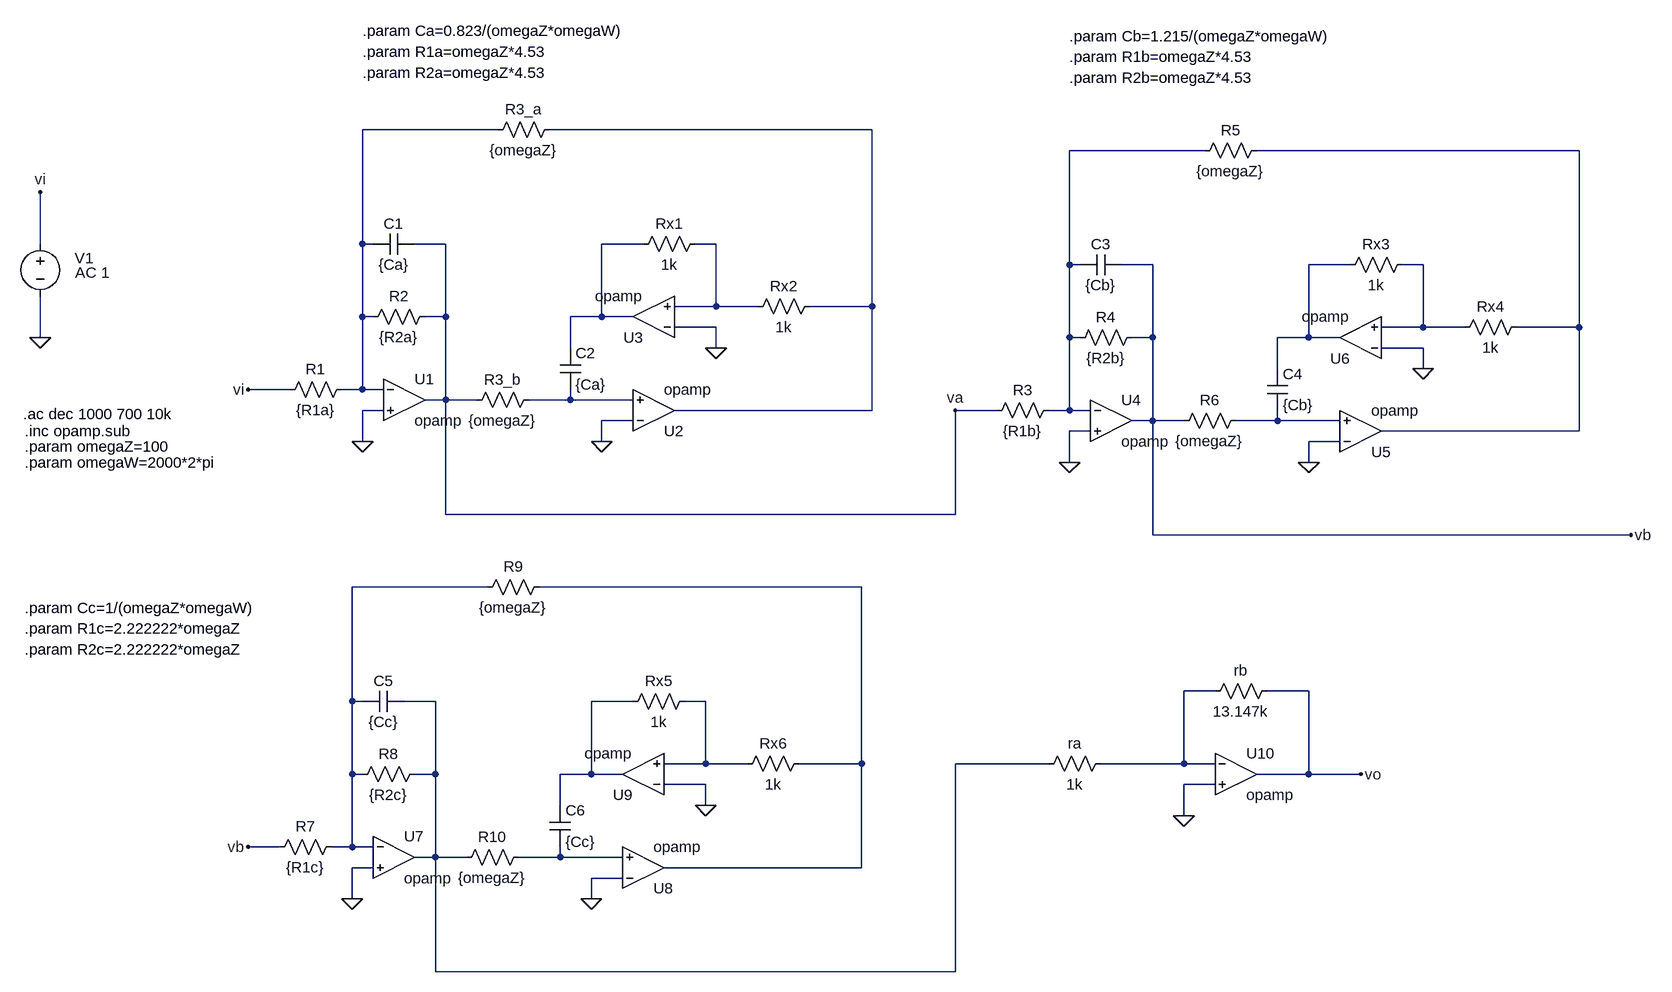
[diagram p0: schematic Draft1.asc]
Draft1.asc, the LTspice schematic file:
Version 4
SHEET 1 1100 680
WIRE -688 -704 -896 -704
WIRE -112 -704 -608 -704
WIRE 400 -672 192 -672
WIRE 976 -672 480 -672
WIRE -1392 -528 -1392 -608
WIRE -896 -528 -896 -704
WIRE -880 -528 -896 -528
WIRE -768 -528 -816 -528
WIRE -464 -528 -528 -528
WIRE -352 -528 -384 -528
WIRE 192 -496 192 -672
WIRE 208 -496 192 -496
WIRE 320 -496 272 -496
WIRE 624 -496 560 -496
WIRE 736 -496 704 -496
WIRE -352 -432 -352 -528
WIRE -352 -432 -416 -432
WIRE -288 -432 -352 -432
WIRE -112 -432 -112 -704
WIRE -112 -432 -208 -432
WIRE -896 -416 -896 -528
WIRE -880 -416 -896 -416
WIRE -768 -416 -768 -528
WIRE -768 -416 -800 -416
WIRE -528 -416 -528 -528
WIRE -528 -416 -576 -416
WIRE -480 -416 -528 -416
WIRE -352 -400 -416 -400
WIRE 736 -400 736 -496
WIRE 736 -400 672 -400
WIRE 800 -400 736 -400
WIRE 976 -400 976 -672
WIRE 976 -400 880 -400
WIRE -1392 -384 -1392 -448
WIRE 192 -384 192 -496
WIRE 208 -384 192 -384
WIRE 320 -384 320 -496
WIRE 320 -384 288 -384
WIRE 560 -384 560 -496
WIRE 560 -384 512 -384
WIRE 608 -384 560 -384
WIRE -576 -368 -576 -416
WIRE -352 -368 -352 -400
WIRE 736 -368 672 -368
WIRE 512 -336 512 -384
WIRE 736 -336 736 -368
WIRE -1008 -304 -1072 -304
WIRE -896 -304 -896 -416
WIRE -896 -304 -928 -304
WIRE -864 -304 -896 -304
WIRE -768 -288 -768 -416
WIRE -768 -288 -800 -288
WIRE -720 -288 -768 -288
WIRE -576 -288 -576 -304
WIRE -576 -288 -640 -288
WIRE -480 -288 -576 -288
WIRE -864 -272 -896 -272
WIRE -112 -272 -112 -432
WIRE -112 -272 -416 -272
WIRE 80 -272 16 -272
WIRE 192 -272 192 -384
WIRE 192 -272 160 -272
WIRE 224 -272 192 -272
WIRE -480 -256 -528 -256
WIRE 320 -256 320 -384
WIRE 320 -256 288 -256
WIRE 368 -256 320 -256
WIRE 512 -256 512 -272
WIRE 512 -256 448 -256
WIRE 608 -256 512 -256
WIRE 224 -240 192 -240
WIRE 976 -240 976 -400
WIRE 976 -240 672 -240
WIRE -896 -224 -896 -272
WIRE -528 -224 -528 -256
WIRE 608 -224 560 -224
WIRE 192 -192 192 -240
WIRE 560 -192 560 -224
WIRE -768 -112 -768 -288
WIRE 16 -112 16 -272
WIRE 16 -112 -768 -112
WIRE 320 -80 320 -256
WIRE 1056 -80 320 -80
WIRE -704 0 -912 0
WIRE -128 0 -624 0
WIRE 416 160 368 160
WIRE 560 160 496 160
WIRE -912 176 -912 0
WIRE -896 176 -912 176
WIRE -784 176 -832 176
WIRE -480 176 -544 176
WIRE -368 176 -400 176
WIRE -368 272 -368 176
WIRE -368 272 -432 272
WIRE -304 272 -368 272
WIRE -128 272 -128 0
WIRE -128 272 -224 272
WIRE 160 272 16 272
WIRE 368 272 368 160
WIRE 368 272 240 272
WIRE 416 272 368 272
WIRE -912 288 -912 176
WIRE -896 288 -912 288
WIRE -784 288 -784 176
WIRE -784 288 -816 288
WIRE -544 288 -544 176
WIRE -544 288 -592 288
WIRE -496 288 -544 288
WIRE 560 288 560 160
WIRE 560 288 480 288
WIRE 640 288 560 288
WIRE -368 304 -432 304
WIRE 416 304 368 304
WIRE -592 336 -592 288
WIRE -368 336 -368 304
WIRE 368 352 368 304
WIRE -1024 400 -1072 400
WIRE -912 400 -912 288
WIRE -912 400 -944 400
WIRE -880 400 -912 400
WIRE -784 416 -784 288
WIRE -784 416 -816 416
WIRE -736 416 -784 416
WIRE -592 416 -592 400
WIRE -592 416 -656 416
WIRE -496 416 -592 416
WIRE -880 432 -912 432
WIRE -128 432 -128 272
WIRE -128 432 -432 432
WIRE -496 448 -544 448
WIRE -912 480 -912 432
WIRE -544 480 -544 448
WIRE -784 592 -784 416
WIRE 16 592 16 272
WIRE 16 592 -784 592
FLAG -352 -368 0
FLAG -528 -224 0
FLAG -896 -224 0
FLAG 736 -336 0
FLAG 560 -192 0
FLAG 192 -192 0
FLAG -368 336 0
FLAG -544 480 0
FLAG -912 480 0
FLAG -1072 -304 vi
FLAG -1392 -384 0
FLAG -1392 -608 vi
FLAG 1056 -80 vb
FLAG 16 -272 va
FLAG -1072 400 vb
FLAG 368 352 0
FLAG 640 288 vo
SYMBOL res -912 -320 R90
WINDOW 0 0 56 VBottom 2
WINDOW 3 32 56 VTop 2
SYMATTR InstName R1
SYMATTR Value {R1a}
SYMBOL res -784 -432 R90
WINDOW 0 0 56 VBottom 2
WINDOW 3 32 56 VTop 2
SYMATTR InstName R2
SYMATTR Value {R2a}
SYMBOL cap -816 -544 R90
WINDOW 0 0 32 VBottom 2
WINDOW 3 32 32 VTop 2
SYMATTR InstName C1
SYMATTR Value {Ca}
SYMBOL res -592 -720 R90
WINDOW 0 0 56 VBottom 2
WINDOW 3 32 56 VTop 2
SYMATTR InstName R3_a
SYMATTR Value {omegaZ}
SYMBOL res -624 -304 R90
WINDOW 0 0 56 VBottom 2
WINDOW 3 32 56 VTop 2
SYMATTR InstName R3_b
SYMATTR Value {omegaZ}
SYMBOL res -368 -544 R90
WINDOW 0 0 56 VBottom 2
WINDOW 3 32 56 VTop 2
SYMATTR InstName Rx1
SYMATTR Value 1k
SYMBOL res -192 -448 R90
WINDOW 0 0 56 VBottom 2
WINDOW 3 32 56 VTop 2
SYMATTR InstName Rx2
SYMATTR Value 1k
SYMBOL cap -592 -368 R0
SYMATTR InstName C2
SYMATTR Value {Ca}
SYMBOL Opamps\\opamp -832 -352 R0
SYMATTR InstName U1
SYMBOL Opamps\\opamp -448 -208 M180
SYMATTR InstName U2
SYMBOL Opamps\\opamp -448 -352 R180
SYMATTR InstName U3
SYMBOL res 176 -288 R90
WINDOW 0 0 56 VBottom 2
WINDOW 3 32 56 VTop 2
SYMATTR InstName R3
SYMATTR Value {R1b}
SYMBOL res 304 -400 R90
WINDOW 0 0 56 VBottom 2
WINDOW 3 32 56 VTop 2
SYMATTR InstName R4
SYMATTR Value {R2b}
SYMBOL cap 272 -512 R90
WINDOW 0 0 32 VBottom 2
WINDOW 3 32 32 VTop 2
SYMATTR InstName C3
SYMATTR Value {Cb}
SYMBOL res 496 -688 R90
WINDOW 0 0 56 VBottom 2
WINDOW 3 32 56 VTop 2
SYMATTR InstName R5
SYMATTR Value {omegaZ}
SYMBOL res 464 -272 R90
WINDOW 0 0 56 VBottom 2
WINDOW 3 32 56 VTop 2
SYMATTR InstName R6
SYMATTR Value {omegaZ}
SYMBOL res 720 -512 R90
WINDOW 0 0 56 VBottom 2
WINDOW 3 32 56 VTop 2
SYMATTR InstName Rx3
SYMATTR Value 1k
SYMBOL res 896 -416 R90
WINDOW 0 0 56 VBottom 2
WINDOW 3 32 56 VTop 2
SYMATTR InstName Rx4
SYMATTR Value 1k
SYMBOL cap 496 -336 R0
SYMATTR InstName C4
SYMATTR Value {Cb}
SYMBOL Opamps\\opamp 256 -320 R0
SYMATTR InstName U4
SYMBOL Opamps\\opamp 640 -176 M180
SYMATTR InstName U5
SYMBOL Opamps\\opamp 640 -320 R180
SYMATTR InstName U6
SYMBOL res -928 384 R90
WINDOW 0 0 56 VBottom 2
WINDOW 3 32 56 VTop 2
SYMATTR InstName R7
SYMATTR Value {R1c}
SYMBOL res -800 272 R90
WINDOW 0 0 56 VBottom 2
WINDOW 3 32 56 VTop 2
SYMATTR InstName R8
SYMATTR Value {R2c}
SYMBOL cap -832 160 R90
WINDOW 0 0 32 VBottom 2
WINDOW 3 32 32 VTop 2
SYMATTR InstName C5
SYMATTR Value {Cc}
SYMBOL res -608 -16 R90
WINDOW 0 0 56 VBottom 2
WINDOW 3 32 56 VTop 2
SYMATTR InstName R9
SYMATTR Value {omegaZ}
SYMBOL res -640 400 R90
WINDOW 0 0 56 VBottom 2
WINDOW 3 32 56 VTop 2
SYMATTR InstName R10
SYMATTR Value {omegaZ}
SYMBOL res -384 160 R90
WINDOW 0 0 56 VBottom 2
WINDOW 3 32 56 VTop 2
SYMATTR InstName Rx5
SYMATTR Value 1k
SYMBOL res -208 256 R90
WINDOW 0 0 56 VBottom 2
WINDOW 3 32 56 VTop 2
SYMATTR InstName Rx6
SYMATTR Value 1k
SYMBOL cap -608 336 R0
SYMATTR InstName C6
SYMATTR Value {Cc}
SYMBOL Opamps\\opamp -848 352 R0
SYMATTR InstName U7
SYMBOL Opamps\\opamp -464 496 M180
SYMATTR InstName U8
SYMBOL Opamps\\opamp -464 352 R180
SYMATTR InstName U9
SYMBOL voltage -1392 -544 R0
WINDOW 0 53 38 Left 2
WINDOW 123 54 60 Left 2
WINDOW 39 0 0 Left 0
SYMATTR InstName V1
SYMATTR Value ""
SYMATTR Value2 AC 1
SYMBOL res 256 256 R90
WINDOW 0 0 56 VBottom 2
WINDOW 3 32 56 VTop 2
SYMATTR InstName ra
SYMATTR Value 1k
SYMBOL res 512 144 R90
WINDOW 0 0 56 VBottom 2
WINDOW 3 32 56 VTop 2
SYMATTR InstName rb
SYMATTR Value 13.147k
SYMBOL Opamps\\opamp 448 224 R0
SYMATTR InstName U10
TEXT -1418 -266 Left 2 !.ac dec 1000 700 10k
TEXT -1416 -240 Left 2 !.inc opamp.sub
TEXT -1416 -216 Left 2 !.param omegaZ=100
TEXT -896 -792 Left 2 !.param R2a=omegaZ*4.53
TEXT -896 -824 Left 2 !.param R1a=omegaZ*4.53
TEXT -896 -856 Left 2 !.param Ca=0.823/(omegaZ*omegaW)
TEXT 192 -784 Left 2 !.param R2b=omegaZ*4.53
TEXT 192 -816 Left 2 !.param R1b=omegaZ*4.53
TEXT 192 -848 Left 2 !.param Cb=1.215/(omegaZ*omegaW)
TEXT -1416 96 Left 2 !.param R2c=2.222222*omegaZ
TEXT -1416 64 Left 2 !.param R1c=2.222222*omegaZ
TEXT -1416 32 Left 2 !.param Cc=1/(omegaZ*omegaW)
TEXT -1416 -192 Left 2 !.param omegaW=2000*2*pi

The netlist it stands for:
* Draft1.asc
R1 N001 vi {R1a}
R2 va N001 {R2a}
C1 va N001 {Ca}
R3_a N002 N001 {omegaZ}
R3_b N009 va {omegaZ}
Rx1 N006 N005 1k
Rx2 N002 N006 1k
C2 N005 N009 {Ca}
XU1 N001 0 va opamp Aol=100K GBW=10Meg  ; pins invin noninvin out
XU2 0 N009 N002 opamp Aol=100K GBW=10Meg  ; pins invin noninvin out
XU3 0 N006 N005 opamp Aol=100K GBW=10Meg  ; pins invin noninvin out
R3 N003 va {R1b}
R4 vb N003 {R2b}
C3 vb N003 {Cb}
R5 N004 N003 {omegaZ}
R6 N010 vb {omegaZ}
Rx3 N008 N007 1k
Rx4 N004 N008 1k
C4 N007 N010 {Cb}
XU4 N003 0 vb opamp Aol=100K GBW=10Meg  ; pins invin noninvin out
XU5 0 N010 N004 opamp Aol=100K GBW=10Meg  ; pins invin noninvin out
XU6 0 N008 N007 opamp Aol=100K GBW=10Meg  ; pins invin noninvin out
R7 N011 vb {R1c}
R8 N014 N011 {R2c}
C5 N014 N011 {Cc}
R9 N012 N011 {omegaZ}
R10 N017 N014 {omegaZ}
Rx5 N016 N015 1k
Rx6 N012 N016 1k
C6 N015 N017 {Cc}
XU7 N011 0 N014 opamp Aol=100K GBW=10Meg  ; pins invin noninvin out
XU8 0 N017 N012 opamp Aol=100K GBW=10Meg  ; pins invin noninvin out
XU9 0 N016 N015 opamp Aol=100K GBW=10Meg  ; pins invin noninvin out
V1 vi 0 AC 1
ra N013 N014 1k
rb vo N013 13.147k
XU10 N013 0 vo opamp Aol=100K GBW=10Meg  ; pins invin noninvin out
.ac dec 1000 700 10k
.inc opamp.sub
.param omegaZ=100
.param R2a=omegaZ*4.53
.param R1a=omegaZ*4.53
.param Ca=0.823/(omegaZ*omegaW)
.param R2b=omegaZ*4.53
.param R1b=omegaZ*4.53
.param Cb=1.215/(omegaZ*omegaW)
.param R2c=2.222222*omegaZ
.param R1c=2.222222*omegaZ
.param Cc=1/(omegaZ*omegaW)
.param omegaW=2000*2*pi
.backanno
.end